# EAGLE design Thermistor (EAGLE 6.5.0)
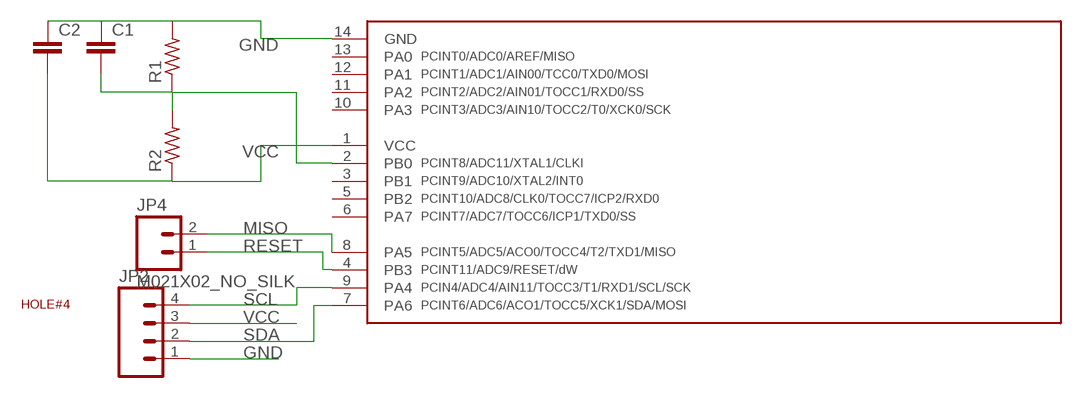
[diagram p0: schematic, sheet 1]

## Parts
C1  C-EUC0805  [C0805]
C2  C-EUC0805  [C0805]
JP2  M041X04_NO_SILK  [1X04_NO_SILK]
JP4  M021X02_NO_SILK  [1X02_NO_SILK]
R1  R-US_R0805  [R0805]
R2  R-US_R0805  [R0805]
U$1  TINY841  [SOIC14]
U$2  HOLE#4  [HOLE-#4]

## Nets
GND: C1.1 C2.1 JP2.1 R1.2 U$1.14(GND)
MISO: JP4.2 U$1.8(PA5)
N$3: C1.2 R1.1 R2.2 U$1.2(PB0)
RESET: JP4.1 U$1.4(PB3)
SCL: JP2.4 U$1.9(PA4)
SDA: JP2.2 U$1.7(PA6)
VCC: C2.2 JP2.3 R2.1 U$1.1(VCC)
Unconnected: U$1.3(PB1) U$1.5(PB2) U$1.6(PA7) U$1.10(PA3) U$1.11(PA2) U$1.12(PA1) U$1.13(PA0) U$2.P$1(HOLE)

## Library data of the parts
C1 C2 = resistor:C-EU: CAPACITOR, European symbol
JP2 = SparkFun-Connectors:M04: Header 4 Standard 4-pin 0.1" header. Use with straight break away headers (SKU : PRT-00116), right angle break away headers (PRT-00553), swiss pins (PRT-00743), machine pins (PRT-00117), and female headers (PRT-00115). Molex polarized connector foot print use with SKU : PRT-08231 with associated crimp pins and housings. 1MM SMD Version SKU: PRT-10208
JP4 = SparkFun-Connectors:M02: Standard 2-pin 0.1" header. Use with - straight break away headers ( PRT-00116) - right angle break away headers (PRT-00553) - swiss pins (PRT-00743) - machine pins (PRT-00117) - female headers (PRT-00115) Molex polarized connector foot print use with: PRT-08233 with associated crimp pins and housings. 2.54_SCREWTERM for use with PRT-10571. 3.5mm Screw Terminal footprints for PRT-08084 5mm Screw Terminal footprints for use with PRT-08433
R1 R2 = resistor:R-US_: RESISTOR, American symbol
U$1 = IntegerLabs:TINY841
U$2 = IntegerLabs:HOLE

## Board
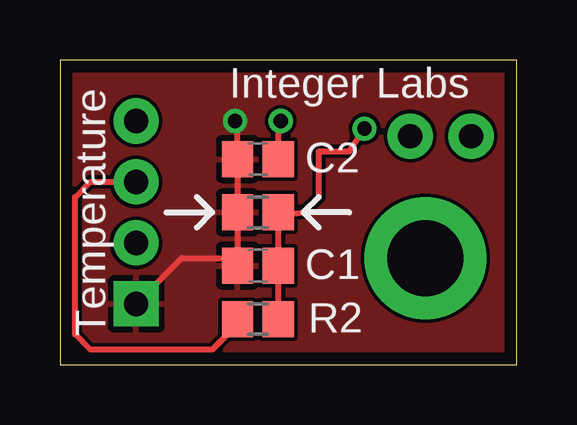
[diagram p1: board, top side]
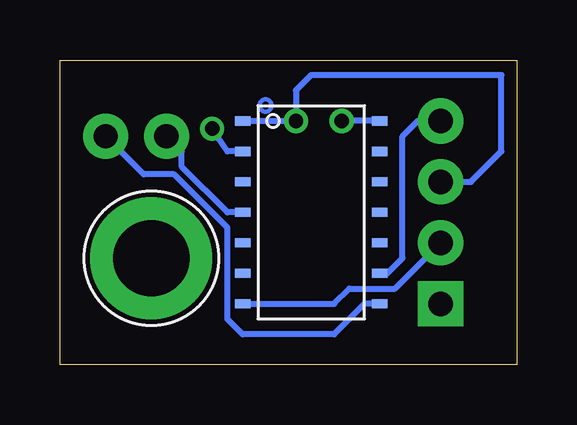
[diagram p2: board, bottom side, seen from below]

Size 19.05 x 12.7 mm. Coordinates in mm from the lower left corner, seen from the top.
Outline: 0,0 19.05,0 19.05,12.7 0,12.7 0,0
Copper layers (1*16): Top 0.0178mm / dielectric 59mil / Bottom 0.0178mm
Design rules "SSC-EAGLE-2Lyr_v1.0.0.3": minimum track width 6mil, minimum drill 14mil, track to track 6mil, track to pad 6mil, pad to pad 6mil, via to via 6mil, smd to smd 6mil, copper to edge 20mil, drill to drill 16mil, minimum pad ring 8mil, minimum via ring 8mil, stop-mask expansion 3mil, vias tented up to drill 0mil, thermal gap 10mil

### Footprints (pad centres in the part's own frame; a part is rotated, then mirrored left to right if it is on the bottom)
C0805 = smd 1.3 x 1.5: 1 -0.85,0; 2 0.85,0
1X04_NO_SILK = drill 1.016 pad 1.88 square: 1 0,0 | drill 1.016 pad 1.88: 2 2.54,0; 3 5.08,0; 4 7.62,0
1X02_NO_SILK = drill 1.016 pad 1.88: 1 0,0; 2 2.54,0
R0805 = smd 1.3 x 1.5: 1 -0.85,0; 2 0.85,0
SOIC14 = smd 0.381 x 0.635: 1 0,-3.175; 2 1.27,-3.175; 3 2.54,-3.175; 4 3.81,-3.175; 5 5.08,-3.175; 6 6.35,-3.175; 7 7.62,-3.175; 8 7.62,2.54; 9 6.35,2.54; 10 5.08,2.54; 11 3.81,2.54; 12 2.54,2.54; 13 1.27,2.54; 14 0,2.54
HOLE-#4 = drill 3.175 pad 5.08: P$1 0,0

### Placement (x,y rotation side)
C1  8.26,4.13 0 top
C2  8.26,8.57 0 top
JP2  3.17,2.54 90 top
JP4  14.61,9.53 0 top
R1  8.26,6.35 180 top
R2  8.26,1.91 0 top
U$1  8.26,10.16 270 bottom
U$2  15.24,4.45 0 bottom

### Tracks (layer width: path | path; a pad name or v marks a point on that pad's centre or on a via)
GND  (via drill 0.6)
  Top 0.254: v7.3,10.16 7.41,10.06 C2.1 R1.2 C1.1 7.09,4.45 5.08,4.45 JP2.1
  Bottom 0.254: U$1.14 v7.3,10.16
  pour Top: 0,0 0,12.7 19.05,12.7 19.05,0
MISO
  Bottom 0.254: U$1.8 6.35,2.54 7.62,1.27 11.43,1.27 12.06,1.91 12.06,5.71 14.29,7.94 15.56,7.94 JP4.2
N$3  (via drill 0.6)
  Top 0.254: R2.2 C1.2 R1.1 9.42,6.25 10.16,6.35 10.79,6.99 10.79,8.89 12.06,8.89 v12.7,9.84
  Bottom 0.254: U$1.2 12.06,8.89 v12.7,9.84
RESET
  Bottom 0.254: U$1.4 12.06,6.35 13.97,8.26 13.97,8.89 JP4.1
SCL
  Bottom 0.254: U$1.9 5.4,3.81 4.76,4.45 4.76,9.53 4.13,10.16 JP2.4
SDA
  Bottom 0.254: U$1.7 7.62,2.54 6.99,3.17 5.08,3.17 JP2.2
VCC  (via drill 0.6)
  Top 0.254: C2.2 9.11,10.06 v9.21,10.16 | R2.1 7.41,1.69 6.35,0.64 1.27,0.64 0.64,1.27 0.64,6.99 1.27,7.62 JP2.3
  Bottom 0.254: U$1.1 v9.21,10.16 9.21,11.43 8.57,12.06 0.64,12.06 0.64,8.89 1.91,7.62 JP2.3
(copper drawn outside any net)
  shapes: Bottom circle x1

### Text on the board
tPlace: Integer Labs | Temperature